# Altium schematic sheet Updated Project Schematic.SchDoc
size A
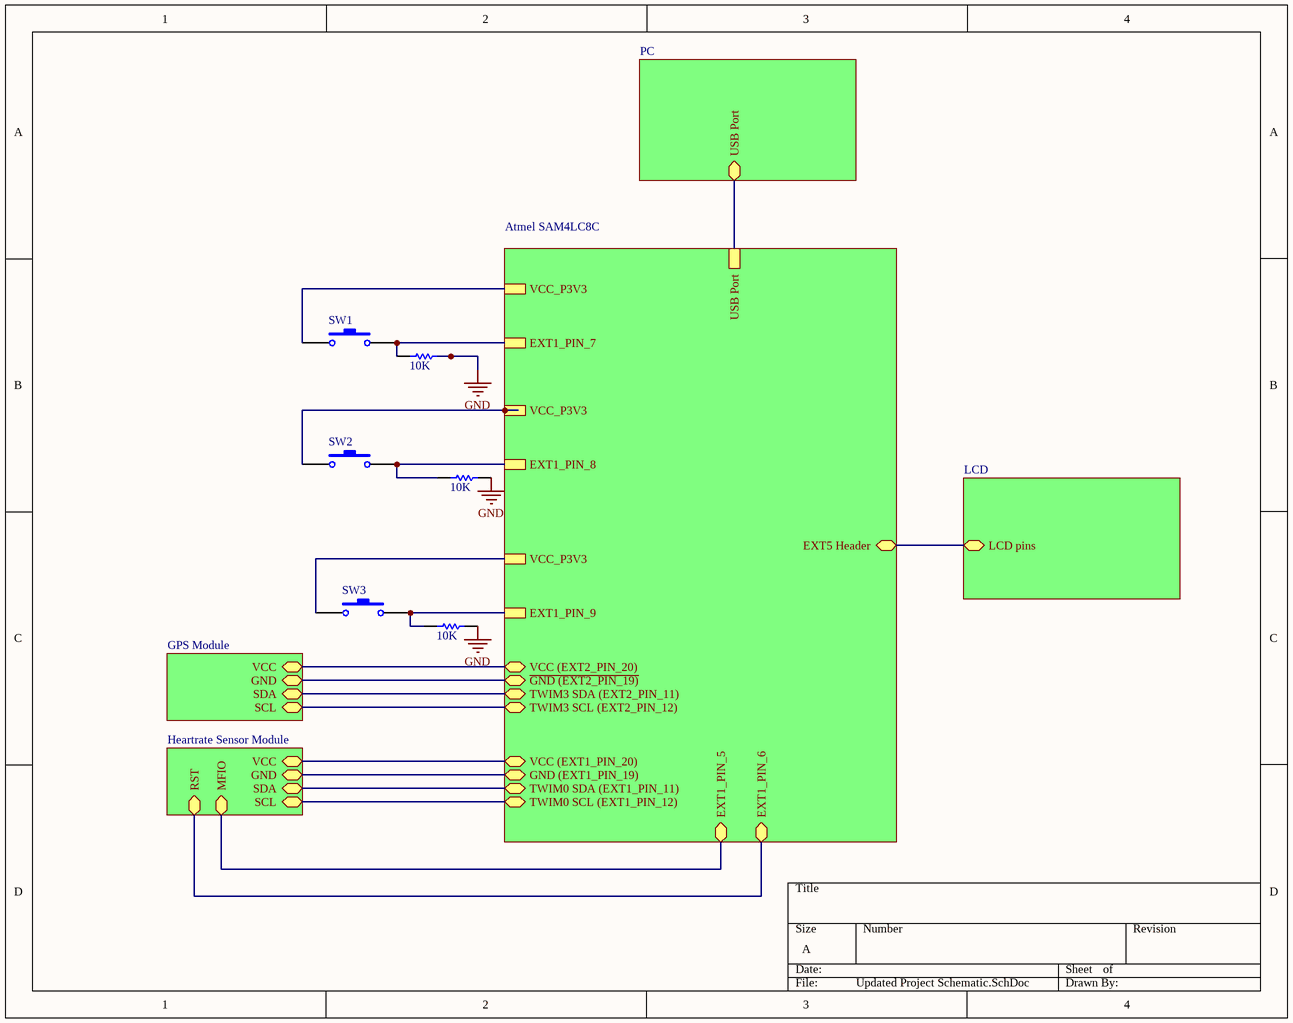
[diagram p0: Updated Project Schematic.SchDoc]

## Parts
(Parts that share a designator on the sheet are numbered #1, #2 ... from top to bottom, then left to right.)
R?#1  value 10K  [AXIAL-0.3]  (hidden comment: Res1)
R?#2  value 10K  [AXIAL-0.3]  (hidden comment: Res1)
R?#3  value 10K  [AXIAL-0.3]  (hidden comment: Res1)
SW1  SW-PB  [SPST-2]  (value not drawn)
SW2  SW-PB  [SPST-2]  (value not drawn)
SW3  SW-PB  [SPST-2]  (value not drawn)

## Sub-sheets
Atmel SAM4LC8C = File Name: USB Port, VCC_P3V3, EXT1_PIN_7, VCC_P3V3, EXT1_PIN_8, VCC (EXT2_PIN_20) (bidir), ~{GND (EXT2_PIN_19)} (bidir), TWIM3 SDA (EXT2_PIN_11) (bidir), TWIM3 SCL (EXT2_PIN_12) (bidir), VCC (EXT1_PIN_20) (bidir), GND (EXT1_PIN_19) (bidir), TWIM0 SDA (EXT1_PIN_11) (bidir), TWIM0 SCL (EXT1_PIN_12) (bidir), EXT1_PIN_5 (bidir), EXT1_PIN_6 (bidir), EXT5 Header (bidir), EXT1_PIN_9, VCC_P3V3
GPS Module = File Name: SCL (bidir), SDA (bidir), GND (bidir), VCC (bidir)
Heartrate Sensor Module = File Name: MFIO (bidir), RST (bidir), SCL (bidir), SDA (bidir), GND (bidir), VCC (bidir)
LCD = File Name: LCD pins (bidir)
PC = File Name: USB Port (bidir)

## Nets
GND: R?#1.1 R?#2.1 R?#3.1
NetR?#1_2: R?#1.2 SW1.2 ; sheet Atmel SAM4LC8C/EXT1_PIN_7
NetR?#2_2: R?#2.2 SW2.2 ; sheet Atmel SAM4LC8C/EXT1_PIN_8
NetR?#3_2: R?#3.2 SW3.2 ; sheet Atmel SAM4LC8C/EXT1_PIN_9
NetSW1_1: SW1.1 ; sheet Atmel SAM4LC8C/VCC_P3V3
NetSW2_1: SW2.1 ; sheet Atmel SAM4LC8C/VCC_P3V3
NetSW3_1: SW3.1 ; sheet Atmel SAM4LC8C/VCC_P3V3
(unnamed): sheet Atmel SAM4LC8C/USB Port, sheet PC/USB Port
(unnamed): sheet Atmel SAM4LC8C/VCC (EXT2_PIN_20), sheet GPS Module/VCC
(unnamed): sheet Atmel SAM4LC8C/~{GND (EXT2_PIN_19)}, sheet GPS Module/GND
(unnamed): sheet Atmel SAM4LC8C/TWIM3 SDA (EXT2_PIN_11), sheet GPS Module/SDA
(unnamed): sheet Atmel SAM4LC8C/TWIM3 SCL (EXT2_PIN_12), sheet GPS Module/SCL
(unnamed): sheet Atmel SAM4LC8C/VCC (EXT1_PIN_20), sheet Heartrate Sensor Module/VCC
(unnamed): sheet Atmel SAM4LC8C/GND (EXT1_PIN_19), sheet Heartrate Sensor Module/GND
(unnamed): sheet Atmel SAM4LC8C/TWIM0 SDA (EXT1_PIN_11), sheet Heartrate Sensor Module/SDA
(unnamed): sheet Atmel SAM4LC8C/TWIM0 SCL (EXT1_PIN_12), sheet Heartrate Sensor Module/SCL
(unnamed): sheet Atmel SAM4LC8C/EXT1_PIN_5, sheet Heartrate Sensor Module/MFIO
(unnamed): sheet Atmel SAM4LC8C/EXT1_PIN_6, sheet Heartrate Sensor Module/RST
(unnamed): sheet Atmel SAM4LC8C/EXT5 Header, sheet LCD/LCD pins

## Notes on the sheet
- Labels drawn without touching a wire or pin: PIN_PC24

## Library data of the parts
R?#1-R?#3 = Res1: Resistor; Published: 8-Jun-2000; LatestRevisionDate: 17-Jul-2002; LatestRevisionNote: Re-released for DXP Platform.; PackageReference: AXIAL-0.3; Publisher: Altium Limited; PackageDescription: Axial Device, Thru-Hole; 2 Leads; 0.3 in Pin Spacing
SW1-SW3 = SW-PB: Switch; Published: 24-Mar-1999; LatestRevisionDate: 17-Jul-2002; LatestRevisionNote: Re-released for DXP Platform.; PackageReference: SPST-2; Publisher: Altium Limited; PackageDescription: Switch; 2 Leads